# Altium project PiVO_shield.PrjPcb
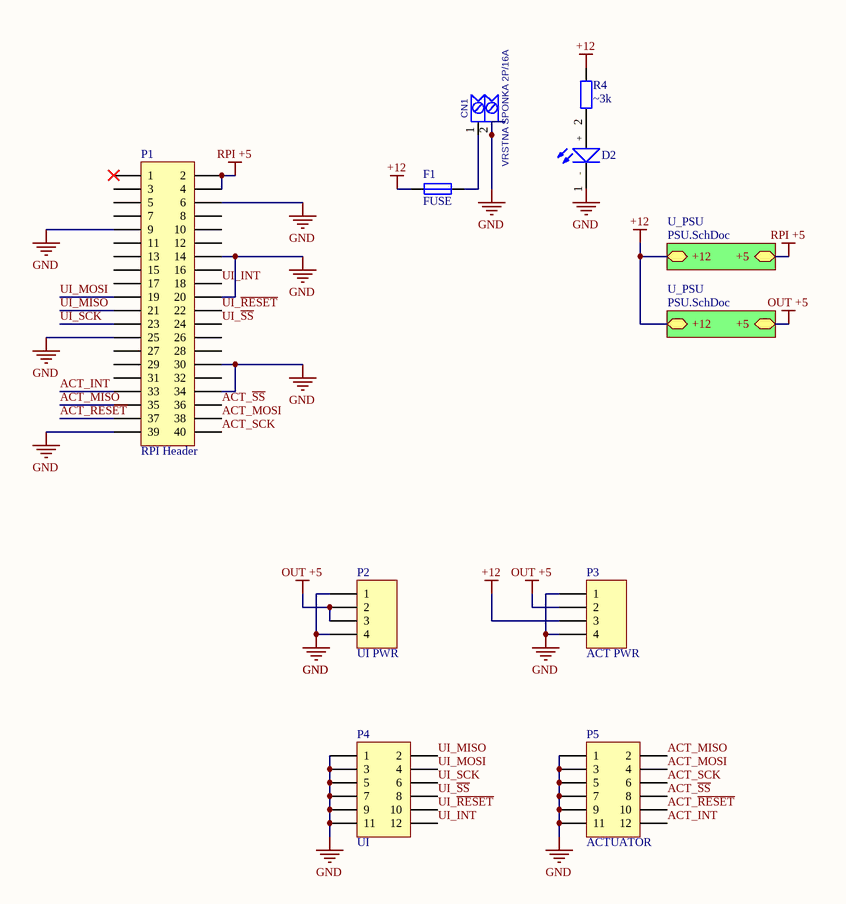
[diagram p0: main.SchDoc]
2 sheets, 35 parts. Net scope: hierarchical (ports join the sheet entries above them; power ports are global).
Board file: PCB2.PcbDoc
Sheets:
  main.SchDoc
    U_PSU = PSU.SchDoc
    U_PSU = PSU.SchDoc

## Sheet main.SchDoc
size A4; SheetNumber: 1; SheetTotal: 2

### Parts
CN1  VRSTNA SPONKA 2P/16A  [VRSTNA SPONKA 2P/16A]
D2  LED  [LED1608_0603I_L]  (value not drawn)
F1  FUSE  [R1005_0402i_M]
P1  RPI Header  [HDR2X20]
P2  UI PWR  [HDR1X4]
P3  ACT PWR  [HDR1X4]
P4  UI  [1.27mm headet tht]
P5  ACTUATOR  [1.27mm headet tht]
R4  ~3k  [R1005_0402i_L]

### Sub-sheets
U_PSU = PSU.SchDoc: +12 (bidir), +5 (bidir)
U_PSU = PSU.SchDoc: +12 (bidir), +5 (bidir)

### Nets
+12: F1.1 P3.3 R4.1 ; sheet U_PSU/+12, sheet U_PSU/+12
GND: CN1.2 D2.1(-) P1.6 P1.9 P1.14 P1.20 P1.25 P1.30 P1.34 P1.39 P2.1 P2.4 P3.1 P3.4 P4.1 P4.3 P4.5 P4.7 P4.9 P4.11 P5.1 P5.3 P5.5 P5.7 P5.9 P5.11
OUT +5: P2.2 P2.3 P3.2 ; sheet U_PSU/+5
RPI +5: P1.2 P1.4 ; sheet U_PSU/+5
ACT_INT: P1.33 P5.12
ACT_MISO: P1.35 P5.2
ACT_MOSI: P1.38 P5.4
ACT_~{RESET}: P1.37 P5.10
ACT_~{SS}: P1.36 P5.8
ACT_SCK: P1.40 P5.6
UI_INT: P1.18 P4.12
UI_MISO: P1.21 P4.2
UI_MOSI: P1.19 P4.4
UI_~{RESET}: P1.22 P4.10
UI_~{SS}: P1.24 P4.8
UI_SCK: P1.23 P4.6
NetCN1_1: CN1.1 F1.2
NetD2_2: D2.2(+) R4.2

Not connected (* = marked no-connect by the designer): P1 1* 3 5 7 8 10 11 12 13 15 16 17 26 27 28 29 31 32

### Library data of the parts
P1 = Header 20X2: Header, 20-Pin, Dual row; LatestRevisionDate: 17-Jul-2002; LatestRevisionNote: Re-released for DXP Platform.; Publisher: Altium Limited
P2 P3 = Header 4: Header, 4-Pin; LatestRevisionDate: 17-Jul-2002; LatestRevisionNote: Re-released for DXP Platform.; Publisher: Altium Limited
P4 P5 = Header 6X2: Header, 6-Pin, Dual row; LatestRevisionDate: 17-Jul-2002; LatestRevisionNote: Re-released for DXP Platform.; Publisher: Altium Limited
R4 = R
CN1 = VRSTNA SPONKA 2P/16A: Value: *

## Sheet PSU.SchDoc
size A4; SheetNumber: 2; SheetTotal: 2
Used 2 times, as channels U_PSU, U_PSU. Parts and nets are listed once, with the designators drawn on the sheet.
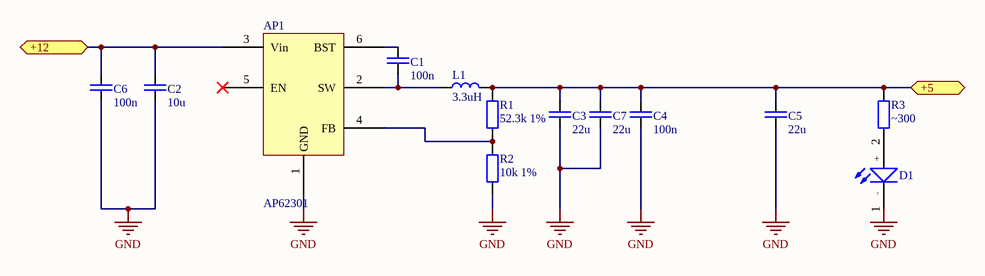
[diagram p1: PSU.SchDoc]

### Parts
AP1  AP62301  [SOT95P280X100-6L]
C1  100n  [C3216_1206I_L]
C2  10u  [C3225_1210I_L]
C3  22u  [C3225_1210I_L]
C4  100n  [C3216_1206I_L]
C5  22u  [C3225_1210I_L]
C6  100n  [C3216_1206I_L]
C7  22u  [C3225_1210I_L]
D1  LED  [LED1608_0603I_L]  (value not drawn)
L1  3.3uH  [INDUCTOR]
R1  52.3k 1%  [R1005_0402i_L]
R2  10k 1%  [R1005_0402i_L]
R3  ~300  [R1005_0402i_L]

### Ports
+5 (bidir), +12 (bidir)

### Nets
GND: AP1.1(GND) C2.2 C3.2 C4.2 C5.2 C6.2 C7.2 D1.1(-) R2.2
+5: C3.1 C4.1 C5.1 C7.1 L1.2 R1.1 R3.1 ; port +5
+12: AP1.3(Vin) C2.1 C6.1 ; port +12
NetAP1_2: AP1.2(SW) C1.2 L1.1
NetAP1_4: AP1.4(FB) R1.2 R2.1
NetAP1_6: AP1.6(BST) C1.1
NetD1_2: D1.2(+) R3.2

Not connected (* = marked no-connect by the designer): AP1 5(EN)*

### Channels
U_PSU: designators end in _U_PSU2; ports +5=RPI +5 +12=+12
U_PSU: designators end in _U_PSU1; ports +5=OUT +5 +12=+12

### Library data of the parts
C1-C7 = C: Capacitor
L1 = L
R1-R3 = R

## Nets that join several sheets
+12: main (F1.1 P3.3 R4.1), U_PSU (AP1_U_PSU2.3 C2_U_PSU2.1 C6_U_PSU2.1), U_PSU (AP1_U_PSU1.3 C2_U_PSU1.1 C6_U_PSU1.1)
GND: main (26 pins), U_PSU (9 pins), U_PSU (9 pins)
OUT +5: main (P2.2 P2.3 P3.2), U_PSU (7 pins)
RPI +5: main (P1.2 P1.4), U_PSU (7 pins)